# EAGLE design LedDriverTest2 (EAGLE 9.4.0)
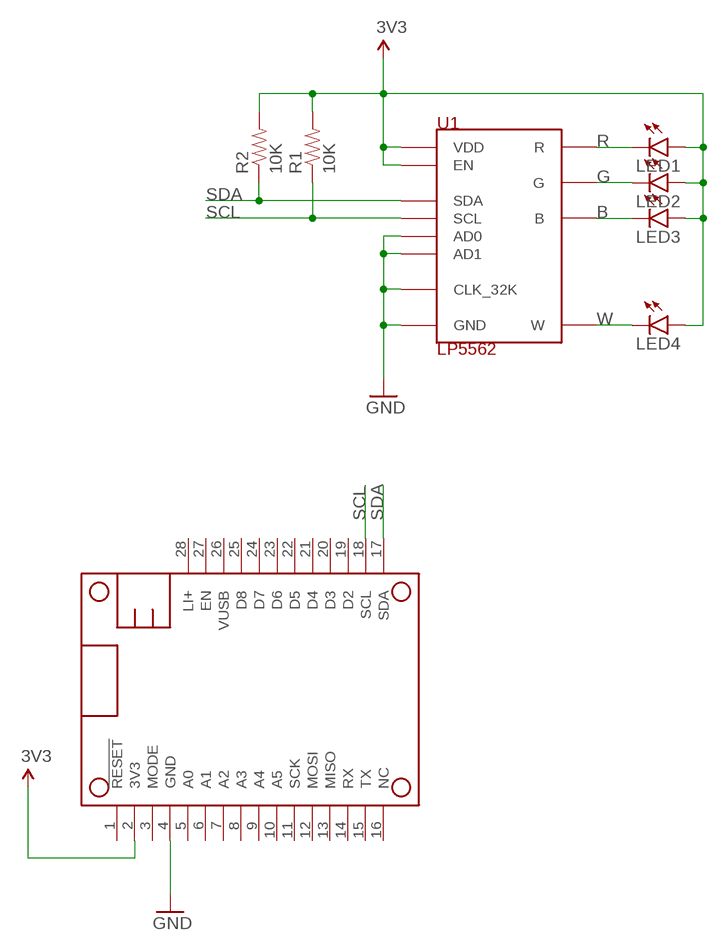
[diagram p0: schematic, sheet 1]

## Parts
LED1  LED3MM  [LED3MM]
LED2  LED3MM  [LED3MM]
LED3  LED3MM  [LED3MM]
LED4  LED3MM  [LED3MM]
MS1  FEATHERWING_NODIM  [FEATHERWING_NODIM]
R1  10K  RES-10K-06030603  [0603-RES]
R2  10K  RES-10K-06030603  [0603-RES]
U1  LP5562  LP5562-LED-DRIVER  [DSBGA12-TI]

## Nets
3V3: LED1.A LED2.A LED3.A LED4.A MS1.2(3V3) R1.2 R2.2 U1.A2(VDD) U1.C3(EN)
B: LED3.K(C) U1.A4(B)
G: LED2.K(C) U1.B4(G)
GND: MS1.4(GND) U1.A3(CLK_32K) U1.B1(AD1) U1.B2(AD0) U1.B3(GND)
R: LED1.K(C) U1.C4(R)
SCL: MS1.18(SCL) R1.1 U1.C2(SCL)
SDA: MS1.17(SDA) R2.1 U1.C1(SDA)
W: LED4.K(C) U1.A1(W)
Unconnected: MS1.1(!RESET) MS1.3(MODE) MS1.5(A0) MS1.6(A1) MS1.7(A2) MS1.8(A3) MS1.9(A4) MS1.10(A5) MS1.11(SCK) MS1.12(MOSI) MS1.13(MISO) MS1.14(RX) MS1.15(TX) MS1.16(NC) MS1.19(D2) MS1.20(D3) MS1.21(D4) MS1.22(D5) MS1.23(D6) MS1.24(D7) MS1.25(D8) MS1.26(VUSB) MS1.27(EN) MS1.28(LI+)

## Library data of the parts
LED1-LED4 = SparkFun-LED:LED: LEDs Standard schematic elements and footprints for 5mm, 3mm, 1206, and 0603 sized LEDs. 5mm - Spark Fun Electronics SKU : COM-00529 (and others)
MS1 = Particle-Mesh:FEATHERWING
R1 R2 = rickk2:RES-10K-0603: RES SMD 10K OHM 5% 1/4W 0603 $ 0.10 https://www.digikey.com/product-detail/en/panasonic-electronic-components/ERJ-PA3J103V/P10KBZCT-ND/5036237
U1 = rickk2:LP5562-LED-DRIVER

## Board
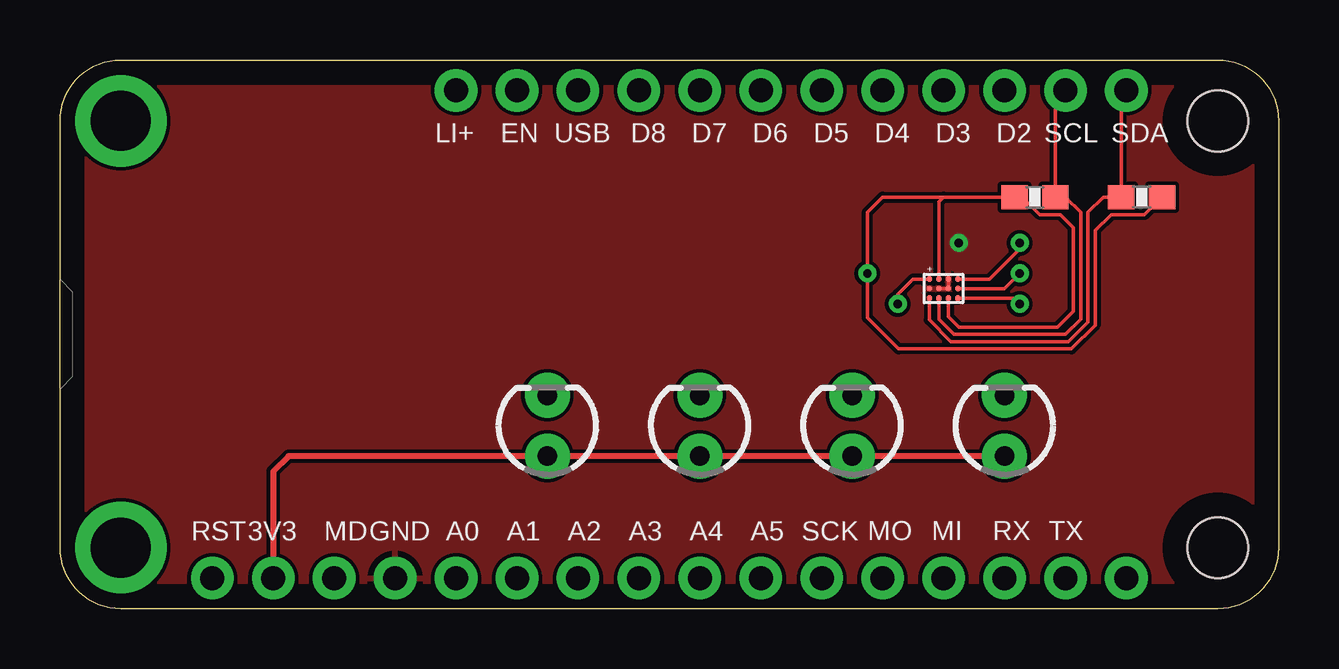
[diagram p1: board, top side]
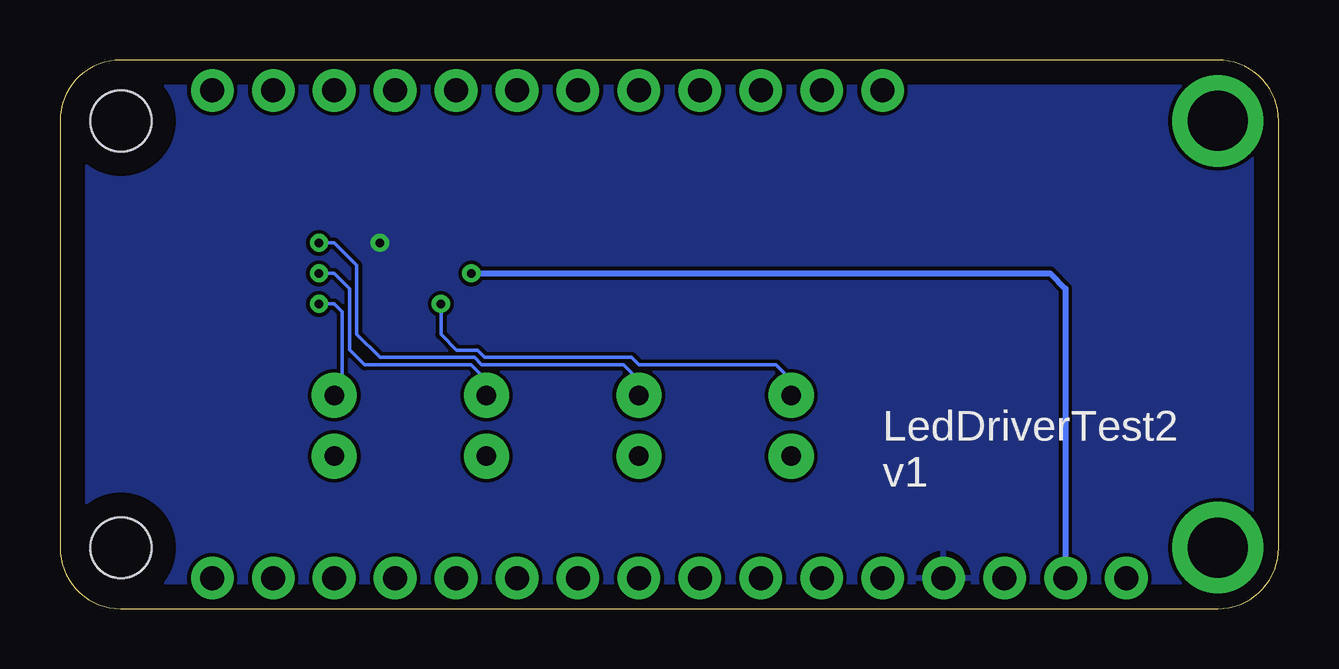
[diagram p2: board, bottom side, seen from below]

Size 50.8 x 22.86 mm. Coordinates in mm from the lower left corner, seen from the top.
Outline: 2.54,22.86 48.26,22.86 arc-90 50.8,20.32 50.8,2.54 arc-90 48.26,0 2.54,0 arc-90 0,2.54 0,20.32 arc-90 2.54,22.86
Copper layers (1*16): Top 0.035mm / dielectric 1.5mm / Bottom 0.035mm
Design rules "default": minimum track width 6mil, minimum drill 0.35mm, track to track 6mil, track to pad 6mil, pad to pad 6mil, via to via 6mil, smd to smd 6mil, copper to edge 40mil, drill to drill 6mil, minimum pad ring 10mil, minimum via ring 8mil, stop-mask expansion 4mil, vias tented up to drill 0mil, thermal gap 10mil

### Footprints (pad centres in the part's own frame; a part is rotated, then mirrored left to right if it is on the bottom)
LED3MM = drill 0.813 pad 1.88: A -1.27,0; K 1.27,0
FEATHERWING_NODIM = drill 1 pad 1.778: 1 6.35,1.27; 2 8.89,1.27; 3 11.43,1.27; 4 13.97,1.27; 5 16.51,1.27; 6 19.05,1.27; 7 21.59,1.27; 8 24.13,1.27; 9 26.67,1.27; 10 29.21,1.27; 11 31.75,1.27; 12 34.29,1.27; 13 36.83,1.27; 14 39.37,1.27; 15 41.91,1.27; 16 44.45,1.27; 17 44.45,21.59; 18 41.91,21.59; 19 39.37,21.59; 20 36.83,21.59; 21 34.29,21.59; 22 31.75,21.59; 23 29.21,21.59; 24 26.67,21.59; 25 24.13,21.59; 26 21.59,21.59; 27 19.05,21.59; 28 16.51,21.59 | drill 2.5 pad 3.81: P$1 2.54,20.32; P$2 2.54,2.54 | hole 2.54: 48.26,20.32; 48.26,2.54
0603-RES = smd 1.1 x 1: 1 -0.85,0; 2 0.85,0
DSBGA12-TI = smd 0.225 x 0.255: A1 -0.6,0.4; A2 -0.2,0.4; A3 0.2,0.4; A4 0.6,0.4; B1 -0.6,0; B2 -0.2,0; B3 0.2,0; B4 0.6,0; C1 -0.6,-0.4; C2 -0.2,-0.4; C3 0.2,-0.4; C4 0.6,-0.4

### Placement (x,y rotation side)
LED1  39.37,7.62 90 top
LED2  33.02,7.62 90 top
LED3  26.67,7.62 90 top
LED4  20.32,7.62 90 top
MS1  0,0 0 top
R1  40.64,17.14 180 top
R2  45.09,17.14 0 top
U1  36.83,13.34 0 top

### Tracks (layer width: path | path; a pad name or v marks a point on that pad's centre or on a via)
3V3  (via drill 0.35)
  Top 0.152: R2.2 45.21,16.42 43.81,16.42 43.16,15.76 43.16,11.81 42.16,10.82 34.95,10.82 33.66,12.12 v33.66,13.97 33.66,16.51 34.29,17.14 36.83,17.14 | 36.83,17.14 R1.2 40.12,17.14 40.84,16.42 41.7,16.42 42.24,15.88 42.24,12.39 41.58,11.73 37.47,11.73 37.03,12.17 U1.C3 | 36.83,17.14 36.63,16.95 U1.A2
  Top 0.254: LED1.A LED2.A LED3.A LED4.A 9.53,6.35 8.89,5.71 MS1.2
  Bottom 0.254: v33.66,13.97 9.53,13.97 8.89,13.34 MS1.2
B  (via drill 0.35)
  Top 0.152: U1.A4 38.73,13.73 40.01,15.01 v40.01,15.24
  Bottom 0.152: v40.01,15.24 39.37,15.24 38.43,14.3 38.43,11.43 37.47,10.46 33.53,10.46 33.22,10.16 27.3,10.16 26.67,9.53 LED3.K
G  (via drill 0.35)
  Top 0.152: U1.B4 39.37,13.34 v40.01,13.97
  Bottom 0.152: v40.01,13.97 39.37,13.97 38.73,13.34 38.73,10.79 38.1,10.16 33.66,10.16 33.02,9.53 LED2.K
GND  (via drill 0.35)
  Top 0.152: U1.A3 U1.B3 U1.B2
  other vias: 37.47,15.24
  pour Top: 0,0 0,25.4 53.34,25.4 53.34,0
  pour Bottom: 0,0 0,27.94 50.8,27.94 50.8,0
R  (via drill 0.35)
  Top 0.152: U1.C4 39.77,12.94 v40.01,12.7
  Bottom 0.152: v40.01,12.7 39.37,12.7 39.04,12.37 39.04,9.22 LED1.K
SCL
  Top 0.152: U1.C2 36.63,12.06 37.27,11.43 41.91,11.43 42.55,12.06 42.55,16.51 41.91,17.14 R1.1 41.49,21.17 MS1.18
SDA
  Top 0.152: U1.C1 36.23,12.03 37.14,11.12 42.04,11.12 42.85,11.94 42.85,16.51 43.48,17.14 R2.1 44.23,21.38 MS1.17
W  (via drill 0.35)
  Top 0.152: U1.A1 35.56,13.73 34.92,13.1 v34.92,12.7
  Bottom 0.152: v34.92,12.7 34.92,11.43 34.27,10.77 33.4,10.77 33.1,10.46 26.98,10.46 26.67,10.16 20.95,10.16 20.32,9.53 LED4.K

### Text on the board
tPlace: LI+ | EN | USB | D8 | D7 | D6 | D5 | D4 | D3 | D2 | SCL | SDA | RST | 3V3 | MD | GND | A0 | A1 | A2 | A3 | A4 | A5 | SCK | MO | MI | RX | TX
bPlace: LedDriverTest2 / v1